# EAGLE schematic SPWF04SA-v1.0.0 (EAGLE 7.7.0)

## Sheet 1 of 2
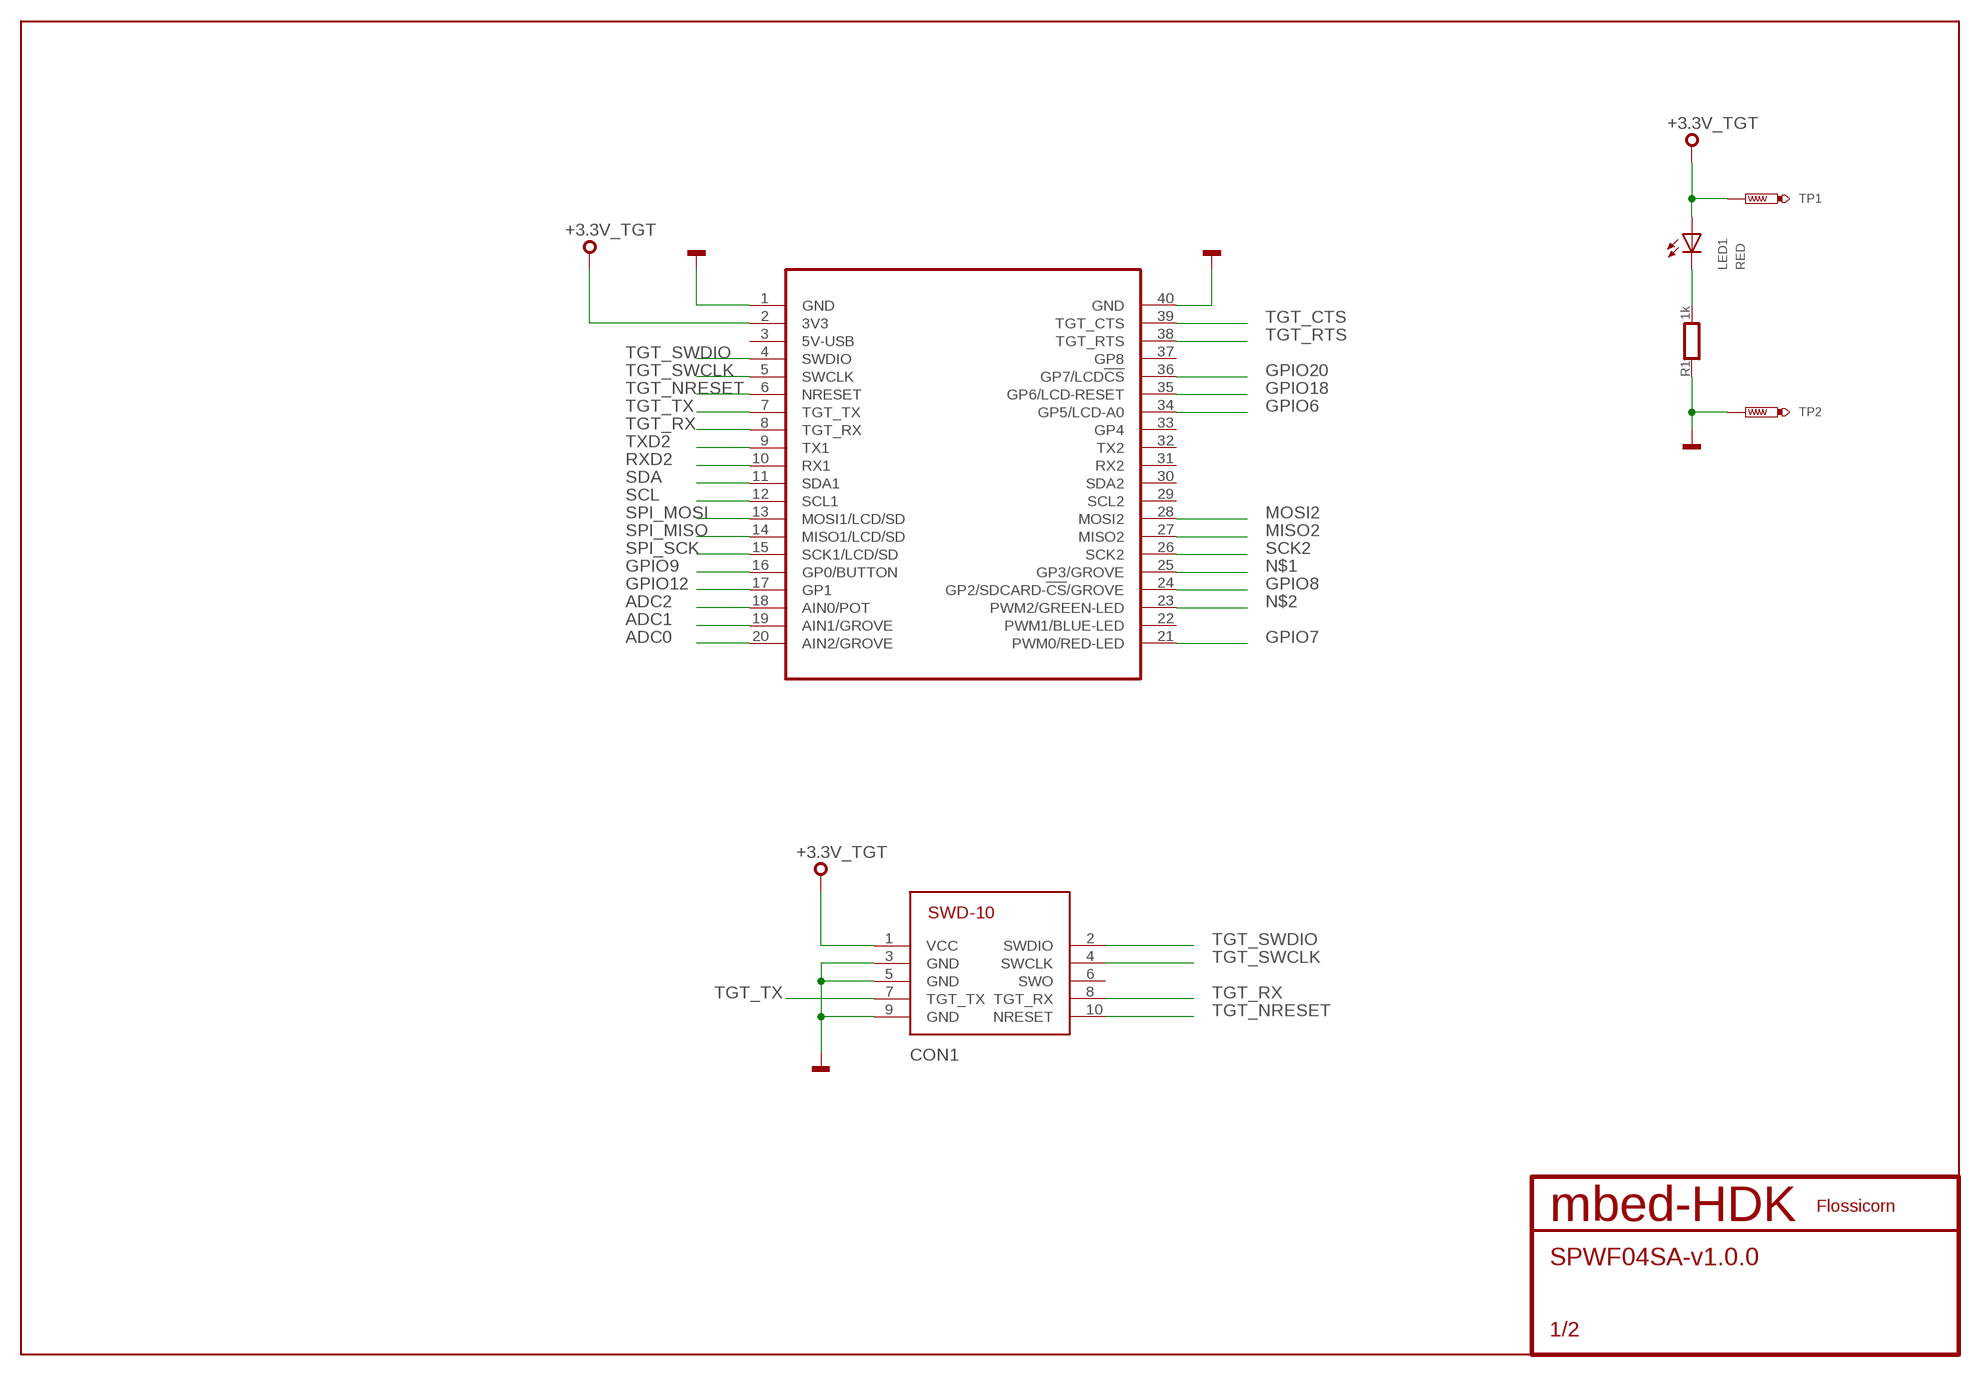
[diagram p0: schematic, sheet 1]

### Parts
CON1  SWD-10/TC2050_SMD  [FTSH-105-02]
LED1  RED  SMD_LED0603  [CHIPLED_0603]
MOD1  MODULE_DAUGHTER  [MODULE_DAUGHTER]
R1  1k  RESISTOR0603  [0603]
SS1  FLOSSICORN0.5  [FLOSSICORN-0.5]
TP1  TEST-POINT-50R-PTH  [TP50-PTH]
TP2  TEST-POINT-50R-PTH  [TP50-PTH]

### Nets
+3.3V_TGT: CON1.1(VCC) LED1.A MOD1.2(3V3) TP1.TP ; also sheet 2
ADC0: MOD1.20(AIN2/GROVE) ; also sheet 2
ADC1: MOD1.19(AIN1/GROVE) ; also sheet 2
ADC2: MOD1.18(AIN0/POT) ; also sheet 2
GND: CON1.3(GND) CON1.5(GND) CON1.9(GND) MOD1.1(GND) MOD1.40(GND) R1.1 TP2.TP ; also sheet 2
GPIO6: MOD1.34(GP5/LCD-A0) ; also sheet 2
GPIO7: MOD1.21(PWM0/RED-LED) ; also sheet 2
GPIO8: MOD1.24(GP2/SDCARD-!CS!/GROVE) ; also sheet 2
GPIO9: MOD1.16(GP0/BUTTON) ; also sheet 2
GPIO12: MOD1.17(GP1) ; also sheet 2
GPIO18: MOD1.35(GP6/LCD-RESET) ; also sheet 2
GPIO20: MOD1.36(GP7/LCD!CS) ; also sheet 2
MISO2: MOD1.27(MISO2) ; also sheet 2
MOSI2: MOD1.28(MOSI2) ; also sheet 2
N$1: MOD1.25(GP3/GROVE)
N$2: MOD1.23(PWM2/GREEN-LED)
PA_1: LED1.C R1.2
RXD2: MOD1.10(RX1) ; also sheet 2
SCK2: MOD1.26(SCK2) ; also sheet 2
SCL: MOD1.12(SCL1) ; also sheet 2
SDA: MOD1.11(SDA1) ; also sheet 2
SPI_MISO: MOD1.14(MISO1/LCD/SD) ; also sheet 2
SPI_MOSI: MOD1.13(MOSI1/LCD/SD) ; also sheet 2
SPI_SCK: MOD1.15(SCK1/LCD/SD) ; also sheet 2
TGT_CTS: MOD1.39(TGT_CTS) ; also sheet 2
TGT_NRESET: CON1.10(NRESET) MOD1.6(NRESET) ; also sheet 2
TGT_RTS: MOD1.38(TGT_RTS) ; also sheet 2
TGT_RX: CON1.8(TGT_RX) MOD1.8(TGT_RX) ; also sheet 2
TGT_SWCLK: CON1.4(SWCLK) MOD1.5(SWCLK) ; also sheet 2
TGT_SWDIO: CON1.2(SWDIO) MOD1.4(SWDIO) ; also sheet 2
TGT_TX: CON1.7(TGT_TX) MOD1.7(TGT_TX) ; also sheet 2
TXD2: MOD1.9(TX1) ; also sheet 2
Unconnected: CON1.6(SWO) MOD1.3(5V-USB) MOD1.22(PWM1/BLUE-LED) MOD1.29(SCL2) MOD1.30(SDA2) MOD1.31(RX2) MOD1.32(TX2) MOD1.33(GP4) MOD1.37(GP8)

## Sheet 2 of 2
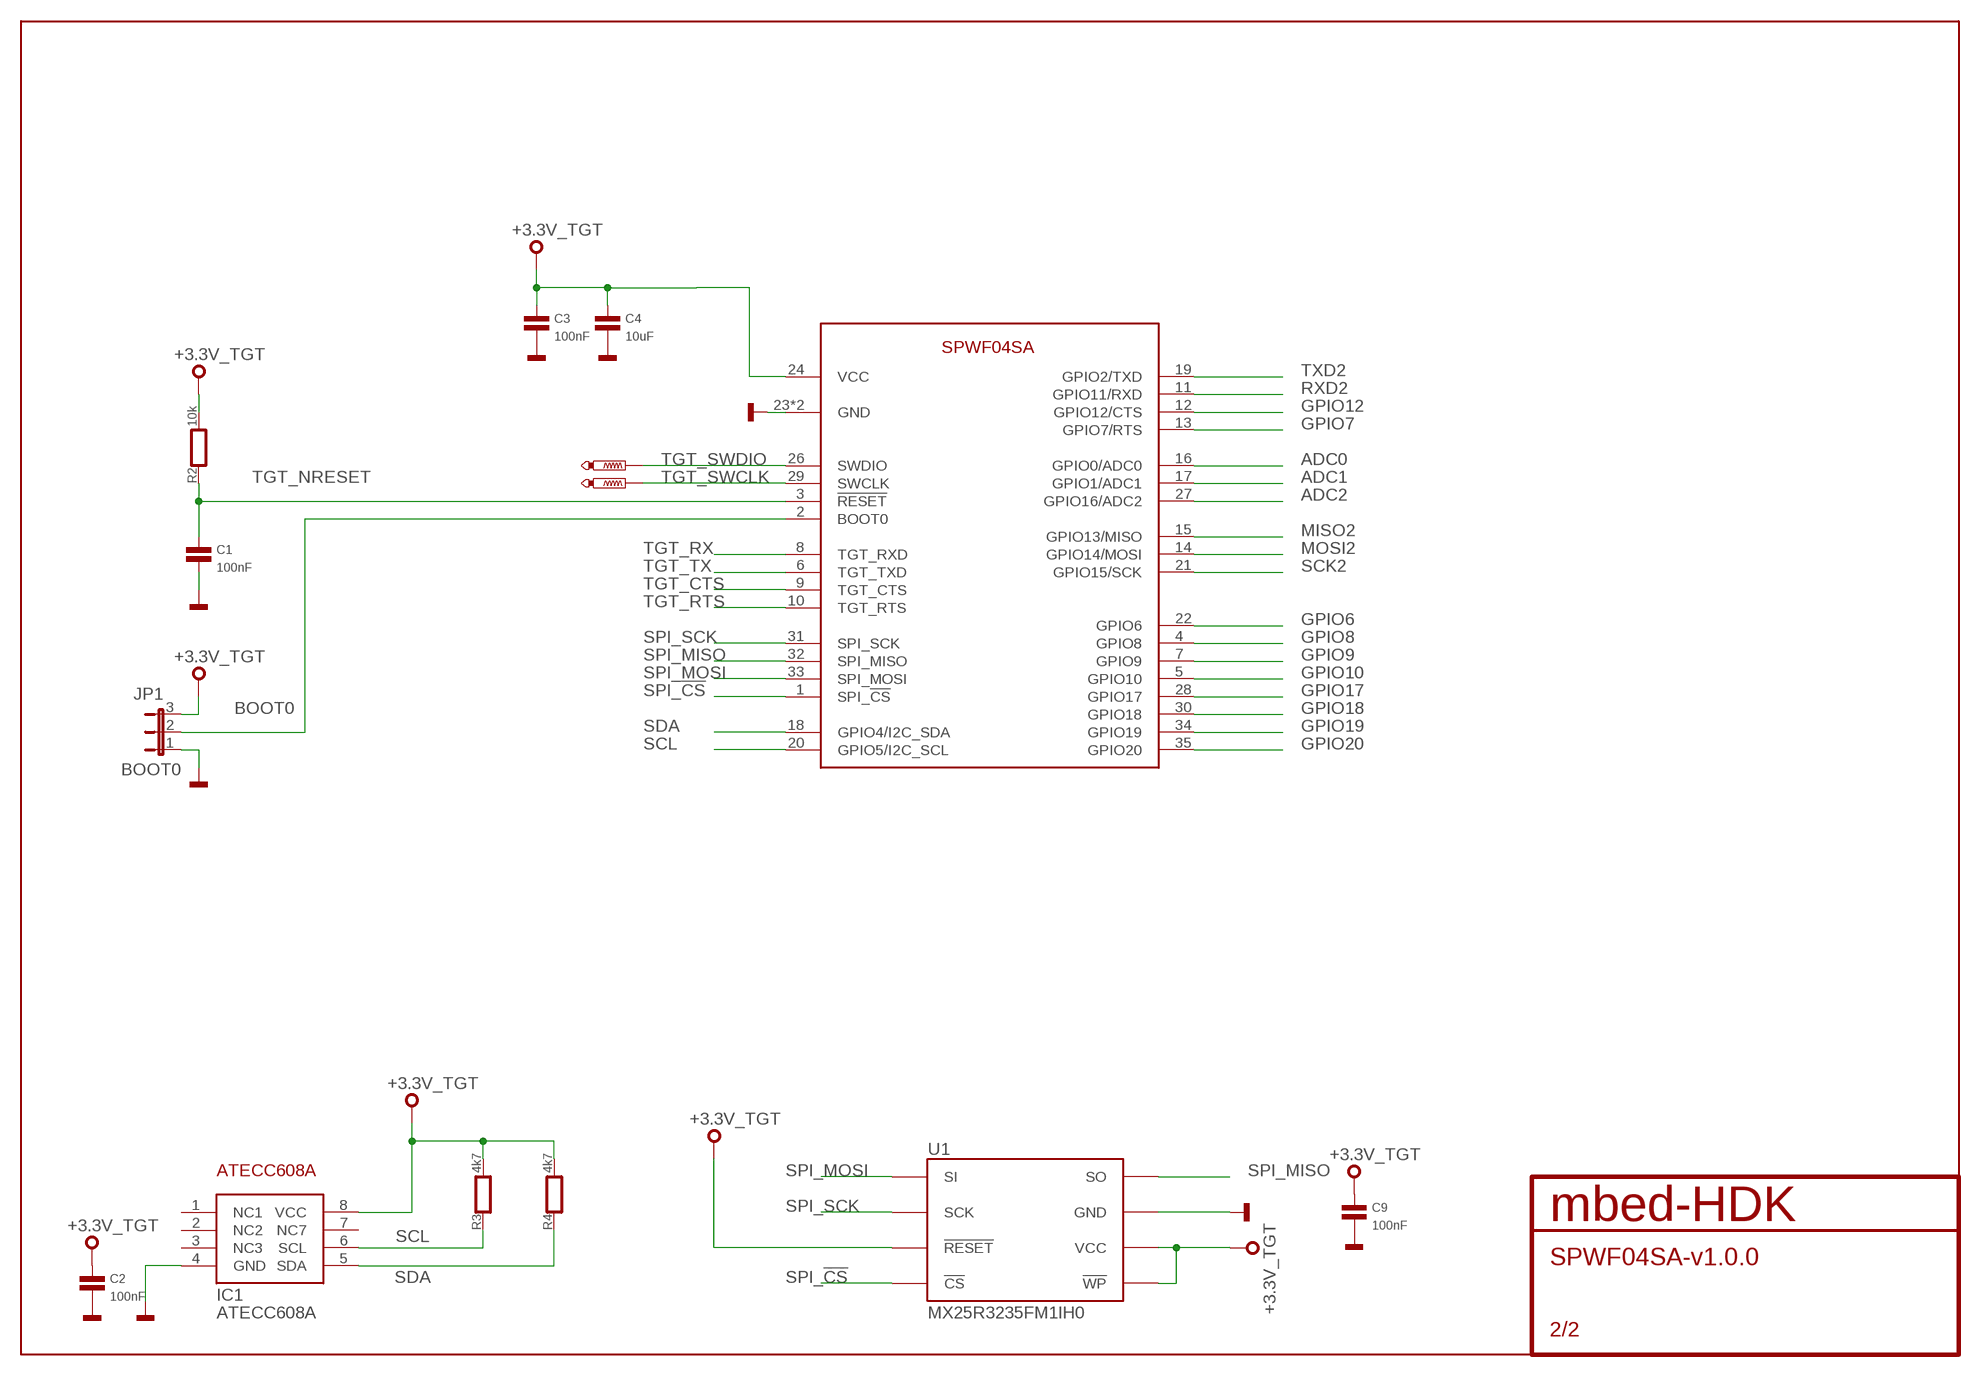
[diagram p1: schematic, sheet 2]

### Parts
C1  100nF  CAPACITOR0603  [0603]
C2  100nF  CAPACITOR0603  [0603]
C3  100nF  CAPACITOR0603  [0603]
C4  10uF  CAPACITOR0603  [0603]
C9  100nF  CAPACITOR0603  [0603]
IC1  ATECC608A  [SO8]
JP1  BOOT0  JP2E  [JP2]
MOD2  SPWF04SA  [SPWF04SA]
R2  10k  RESISTOR0603  [0603]
R3  4k7  RESISTOR0603  [0603]
R4  4k7  RESISTOR0603  [0603]
TP3  PTR1TP10R  [TP10R]
TP4  PTR1TP10R  [TP10R]
U1  MX25R3235FM1IH0  [SO8]

### Nets
+3.3V_TGT: C2.1 C3.1 C4.1 C9.1 IC1.8(VCC) JP1.3 MOD2.24(VCC) R2.2 R3.2 R4.2 U1.3(!WP) U1.7(!RESET) U1.8(VCC) ; also sheet 1
ADC0: MOD2.16(GPIO0/ADC0) ; also sheet 1
ADC1: MOD2.17(GPIO1/ADC1) ; also sheet 1
ADC2: MOD2.27(GPIO16/ADC2) ; also sheet 1
BOOT0: JP1.2 MOD2.2(BOOT0)
GND: C1.2 C2.2 C3.2 C4.2 C9.2 IC1.4(GND) JP1.1 MOD2.23(GND) MOD2.25(GND) U1.4(GND) ; also sheet 1
GPIO6: MOD2.22(GPIO6) ; also sheet 1
GPIO7: MOD2.13(GPIO7/RTS) ; also sheet 1
GPIO8: MOD2.4(GPIO8) ; also sheet 1
GPIO9: MOD2.7(GPIO9) ; also sheet 1
GPIO10: MOD2.5(GPIO10)
GPIO12: MOD2.12(GPIO12/CTS) ; also sheet 1
GPIO17: MOD2.28(GPIO17)
GPIO18: MOD2.30(GPIO18) ; also sheet 1
GPIO19: MOD2.34(GPIO19)
GPIO20: MOD2.35(GPIO20) ; also sheet 1
MISO2: MOD2.15(GPIO13/MISO) ; also sheet 1
MOSI2: MOD2.14(GPIO14/MOSI) ; also sheet 1
RXD2: MOD2.11(GPIO11/RXD) ; also sheet 1
SCK2: MOD2.21(GPIO15/SCK) ; also sheet 1
SCL: IC1.6(SCL) MOD2.20(GPIO5/I2C_SCL) R3.1 ; also sheet 1
SDA: IC1.5(SDA) MOD2.18(GPIO4/I2C_SDA) R4.1 ; also sheet 1
SPI_!CS: MOD2.1(SPI_!CS) U1.1(!CS)
SPI_MISO: MOD2.32(SPI_MISO) U1.2(SO) ; also sheet 1
SPI_MOSI: MOD2.33(SPI_MOSI) U1.5(SI) ; also sheet 1
SPI_SCK: MOD2.31(SPI_SCK) U1.6(SCK) ; also sheet 1
TGT_CTS: MOD2.9(TGT_CTS) ; also sheet 1
TGT_NRESET: C1.1 MOD2.3(!RESET) R2.1 ; also sheet 1
TGT_RTS: MOD2.10(TGT_RTS) ; also sheet 1
TGT_RX: MOD2.8(TGT_RXD) ; also sheet 1
TGT_SWCLK: MOD2.29(SWCLK) TP4.TP ; also sheet 1
TGT_SWDIO: MOD2.26(SWDIO) TP3.TP ; also sheet 1
TGT_TX: MOD2.6(TGT_TXD) ; also sheet 1
TXD2: MOD2.19(GPIO2/TXD) ; also sheet 1
Unconnected: IC1.1(NC1) IC1.2(NC2) IC1.3(NC3) IC1.7(NC7)

## Library data of the parts
C1-C4 C9 = mbed-HDK-RLC:CAPACITOR: Capacitor
CON1 = mbed-HDK-Connector:SWD-10/TC2050: 1mm pitch 10-Pin Cortex Programming Header with optional TC2050 footprint solderless interchangeable
IC1 = blackbriar:ATECC608A
JP1 = blackbriar:JP2E: JUMPER
LED1 = mbed-HDK-Optical:SMD_LED: LED SMD, Colour Red; MF: Wurth Electronics Inc; MFN: 150060RS75000; OC-DIGIKEY: 732-4978-1-ND; OC-MOUSER: 710-150060RS75000; OC-NEWARK: 2322071
MOD1 = blackbriar:MODULE_DAUGHTER
MOD2 = blackbriar:SPWF04SA
R1-R4 = mbed-HDK-RLC:RESISTOR: Resistor
SS1 = blackbriar:FLOSSICORN
TP1 TP2 = mbed-HDK:TEST-POINT
TP3 TP4 = blackbriar:PTR1: TEST PIN
U1 = blackbriar:MX25R3235FM1IH0: Serial Flash 32 Mb 80 Mhz; MF: Macronix; MFN: MX25R3235FM2IH0; OC-DIGIKEY: 1092-1174-ND